# Altium schematic sheet rf_lpf_17_10.SchDoc: mcHF Pro Transceiver RF board
size A3; Author: Krassi Atanassov; CompanyName: MØNKA; Engineer: For radio amateurs experimentation, non-commercial use only. Thank you!; Revision: 0.8.5; SheetTotal: 14
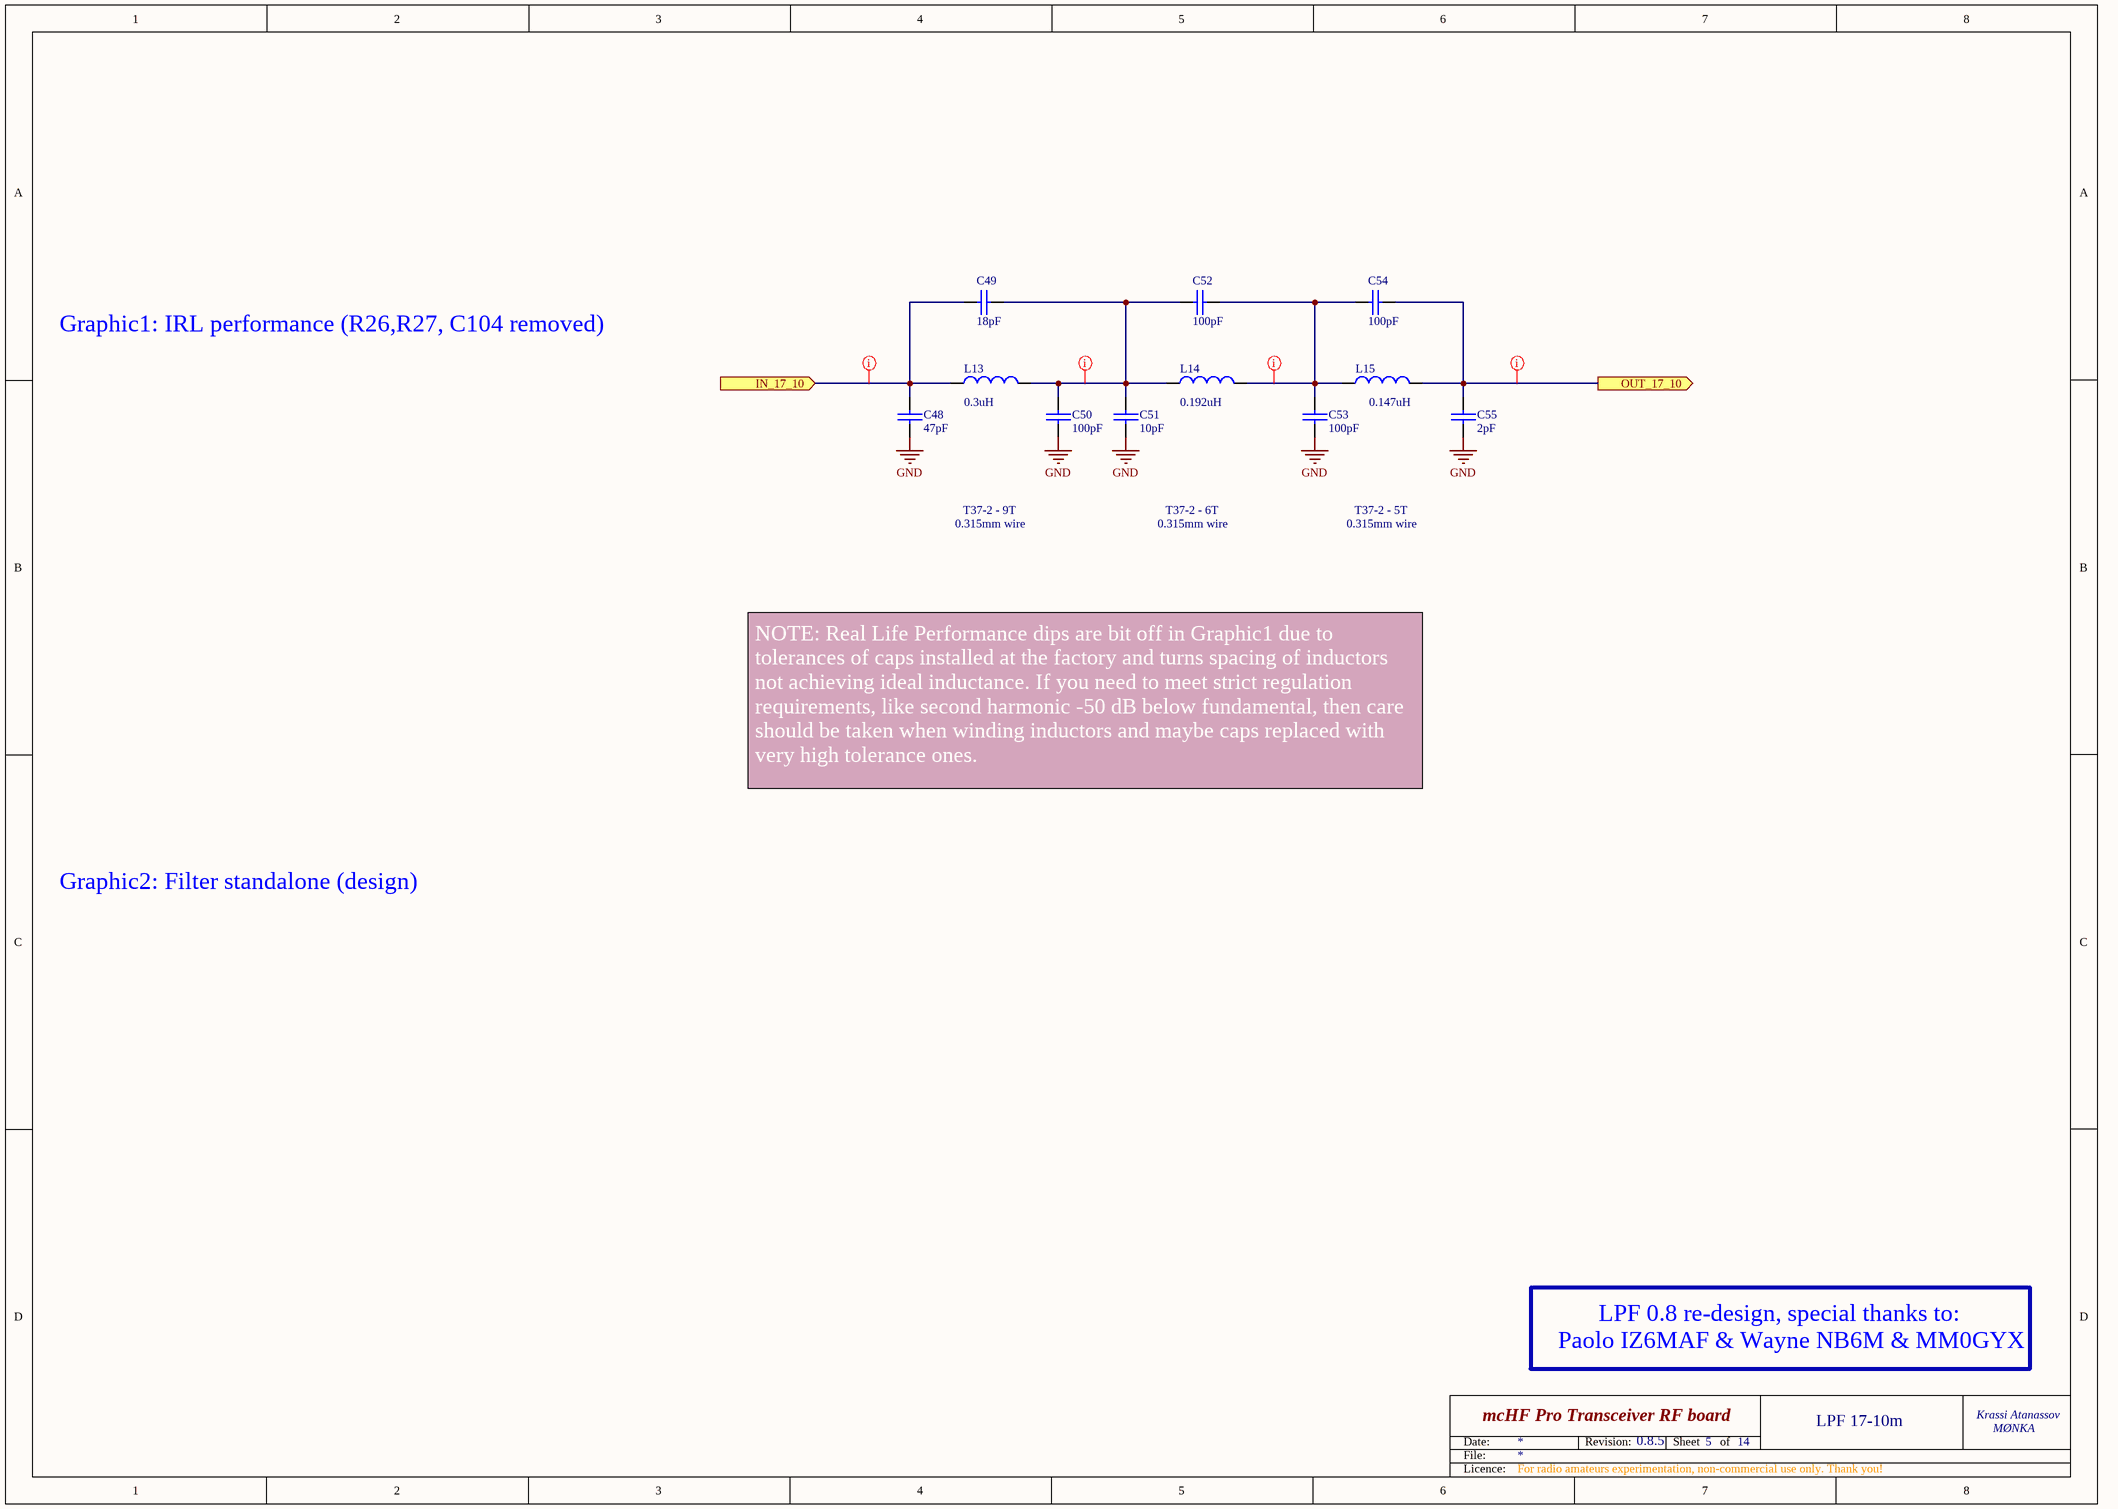
[diagram p0: rf_lpf_17_10.SchDoc]

## Parts
C48  47pF  [0805]
C49  18pF  [0805]
C50  100pF  [0805]
C51  10pF  [0805]
C52  100pF  [0805]
C53  100pF  [0805]
C54  100pF  [0805]
C55  2pF  [0805]
L13  Inductance: 0.3uH  [LPF_IND]  (hidden comment: T37-2)
L14  Inductance: 0.192uH  [LPF_IND]  (hidden comment: T37-2)
L15  Inductance: 0.147uH  [LPF_IND]  (hidden comment: T37-2)

## Ports
IN_17_10 (in), OUT_17_10 (out)

## Nets
GND: C48.1 C50.1 C51.1 C53.1 C55.1
IN_17_10: C48.2 C49.2 L13.1 ; port IN_17_10
OUT_17_10: C54.1 C55.2 L15.2 ; port OUT_17_10
NetC49_1: C49.1 C50.2 C51.2 C52.2 L13.2 L14.1
NetC52_1: C52.1 C53.2 C54.2 L14.2 L15.1

## Layout directives
rule Width Constraint [Pref Width = 30mil    Min Width = 30mil    Max Width = 30mil]: IN_17_10, NetC49_1, NetC52_1, OUT_17_10

## Notes on the sheet
- Graphic1: IRL performance (R26,R27, C104 removed)
- T37-2 - 9T
- T37-2 - 6T
- T37-2 - 5T
- 0.315mm wire
- NOTE: Real Life Performance dips are bit off in Graphic1 due to tolerances of caps installed at the factory and turns spacing of inductors not achieving ideal inductance. If you need to meet strict regulation requirements, like second harmonic -50 dB below fundamental, then care should be taken when winding inductors and maybe caps replaced with very high tolerance ones.
- Graphic2: Filter standalone (design)
- LPF 0.8 re-design, special thanks to:
- Paolo IZ6MAF & Wayne NB6M & MM0GYX
- 5
- LPF 17-10m
- Date:
- File:
- Revision:
- Sheet
- of
- Licence:

## Library data of the parts
C48-C55 = CAP: Capacitor; Notes: COG/NPO; Voltage: 100V
L13-L15 = LPF_IND: T37-2 handwound inductor; Notes: post assembly; Price: 0.20